# EAGLE design ESP_programmer_QFN_2 (EAGLE 8.1.1)
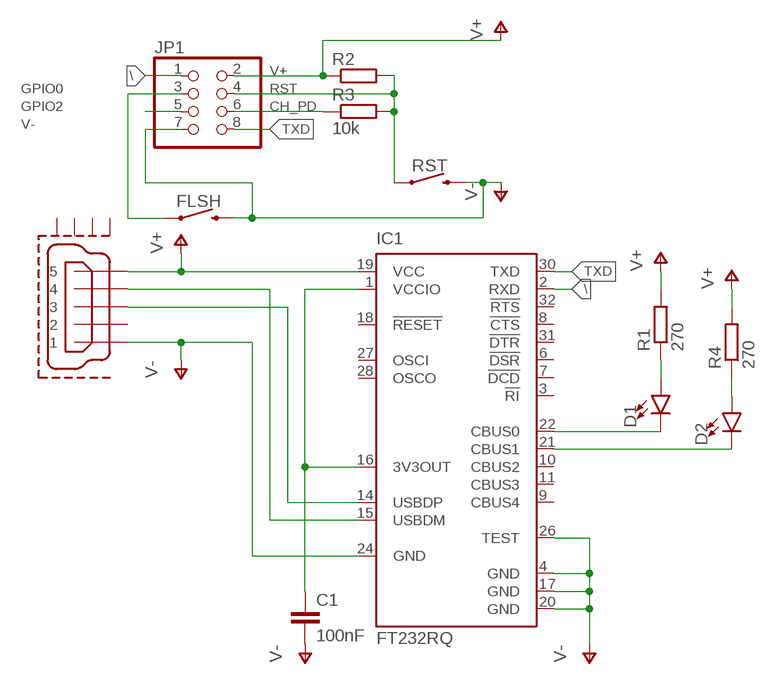
[diagram p0: schematic, sheet 1]

## Parts
C1  100nF  C-EUC1608  [C1608]
D1  TX  LED-BLUE0603  [LED-0603]
D2  RX  LED-BLUE0603  [LED-0603]
FLSH  MOMENTARY-SWITCH-SPST-SMD-5.2-REDUNDANT  [TACTILE_SWITCH_SMD_5.2MM]
IC1  FT232RQ  [QFN32]
JP1  PINHD-2X4  [2X04]
R1  270  RR2012  [R2012]
R2  10k  RR2012  [R2012]
R3  10k  RR2012  [R2012]
R4  270  RR2012  [R2012]
RST  MOMENTARY-SWITCH-SPST-SMD-5.2-REDUNDANT  [TACTILE_SWITCH_SMD_5.2MM]
U1  MICRO-USB-RECEPTACLE47589-0001  [47589-0001]

## Nets
\: IC1.2(RXD) JP1.1
CH_PD: JP1.6 R3.1
GPIO0: FLSH.1 FLSH.2 JP1.3
GPIO2: JP1.5
N$1: D2.A R4.1
N$2: IC1.15(USBDM) U1.4
N$3: IC1.14(USBDP) U1.3
N$4: D1.A R1.1
N$5: C1.1 IC1.1(VCCIO) IC1.16(3V3OUT)
N$6: D1.C IC1.22(CBUS0)
N$8: D2.C IC1.21(CBUS1)
RST: JP1.4 R2.2 R3.2 RST.1 RST.2
TXD: IC1.30(TXD) JP1.8
V+: IC1.19(VCC) JP1.2 R1.2 R2.1 R4.2 U1.5
V-: C1.2 FLSH.3 FLSH.4 IC1.4(GND) IC1.17(GND) IC1.20(GND) IC1.24(GND) IC1.26(TEST) JP1.7 RST.3 RST.4 U1.1
Unconnected: IC1.3(!RI) IC1.6(!DSR) IC1.7(!DCD) IC1.8(!CTS) IC1.9(CBUS4) IC1.10(CBUS2) IC1.11(CBUS3) IC1.18(!RESET) IC1.27(OSCI) IC1.28(OSCO) IC1.31(!DTR) IC1.32(!RTS) U1.2 U1.CASING1(GND1) U1.CASING2(GND2) U1.CASING3(GND3) U1.CASING4(GND4)

## Library data of the parts
C1 = resistor:C-EU: CAPACITOR, European symbol
D1 D2 = SparkFun-LED:LED-BLUE: Blue SMD LED Used in manufacturing of various products at SparkFun Packages: 0603 - SMD 0603 package [Product Link] <http://www.digikey.com/product-detail/en/SMLE12BC7TT86/511-1589-2-ND/1641808> 1206 - SMD1206 package [Product Link] <http://www.digikey.com/product-detail/en/lite-on-inc/LTST-C150TBKT/160-1643-1-ND/573584> SparkFun Products: ESP8266 Thing-Dev Board <https://www.sparkfun.com/products/13711> RedBoard <https://www.sparkfun.com/products/12757>; PROD_ID: DIO-08575; VALUE: BLUE
FLSH RST = SparkFun-Switches:MOMENTARY-SWITCH-SPST: Momentary Switch (Pushbutton) - SPST Normally-open (NO) SPST momentary switches (buttons, pushbuttons). Variants PTH-12MM - 12mm square, through-hole Momentary Pushbutton Switch - 12mm Square <https://www.sparkfun.com/products/9190> (COM-09190) PTH-6.0MM, PTH-6.0MM-KIT - 6.0mm square, through-hole Mini Pushbutton Switch <https://www.sparkfun.com/products/97> (COM-00097) KIT package intended for soldering kit's - only one side of pads' copper is exposed. PTH-RIGHT-ANGLE-KIT - Right-angle, through-hole Right Angle Tactile Button <https://www.sparkfun.com/products/10791> - Used on SparkFun BigTime Watch Kit <https://www.sparkfun.com/products/11734> SMD-12MM - 12mm square, surface-mount Tactile Button - SMD (12mm) <https://www.sparkfun.com/products/12993> (COM-12993) Used on SparkFun PicoBoard <https://www.sparkfun.com/products/11888> SMD-4.5MM - 4.5mm Square Trackball Switch Used on SparkFun Blackberry Trackballer Breakout <https://www.sparkfun.com/products/13169> SMD-4.6MMX2.8MM - 4.60mm x 2.80mm, surface mount Used on SparkFun SAMD21 Mini Breakout <https://www.sparkfun.com/products/13664> SMD-5.2MM, SMD-5.2-REDUNDANT - 5.2mm square, surface-mount Mini Pushbutton Switch - SMD <https://www.sparkfun.com/products/8720> (COM-08720) Used on Arduino Pro Mini <https://www.sparkfun.com/products/11114> REDUNDANT package connects both switch circuits together SMD-6.0X3.5MM - 6.0 x 3.5mm, surface mount Momentary Reset Switch SMD <https://www.sparkfun.com/products/8229> (COM-08229) SMD-6.2MM-TALL - 6.2mm square, surface mount Tactile Button - SMD (6mm) <https://www.sparkfun.com/products/12992> Used on SparkFun Digital Sandbox <https://www.sparkfun.com/products/12651> SMD-RIGHT-ANGLE - Right-angle, surface mount Used on SparkFun Block for Intel® Edison - Arduino <https://www.sparkfun.com/products/13036>; PROD_ID: SWCH-08247; SF_SKU: COM-08720
IC1 = ftdichip:FT232R: Source: http://www.ftdichip.com/Documents/DataSheets/DS_FT232R_v104.pdf; MPN: FT232RQ; OC_FARNELL: 1146033; OC_NEWARK: 91K9919
JP1 = FPAA_pinhead:PINHD-2X4: PIN HEADER
R1-R4 = eagle-ltspice:R: RESISTOR, European symbol; SPICEMODEL: NONE; SPICEPREFIX: R
U1 = con-molex-usb:MICRO-USB-RECEPTACLE: MICRO USB RECEPTACLES Micro-USB Receptacles, SMT, Lead-Free from MOLEX <http://www.molex.com/>. (C) 2014 Tomasz Boleslaw CEDRO, cederom@tlen.pl, http://www.tomek.cedro.info. Version 0.1 (2014-01-17): Initial release. Version 0.2 (2014-02-06): Updated 47589-0001 footprint pins/pads/milling. Following devices are included: 1. 47589-0001 Micro-USB AB Receptacle, Bottom Mount, SMT, Lead-Free <http://www.molex.com/molex/products/datasheet.jsp?part=active/0475890001_IO_CONNECTORS.xml> (Technical Drawing <http://www.molex.com/pdm_docs/sd/475890001_sd.pdf>).

## Board
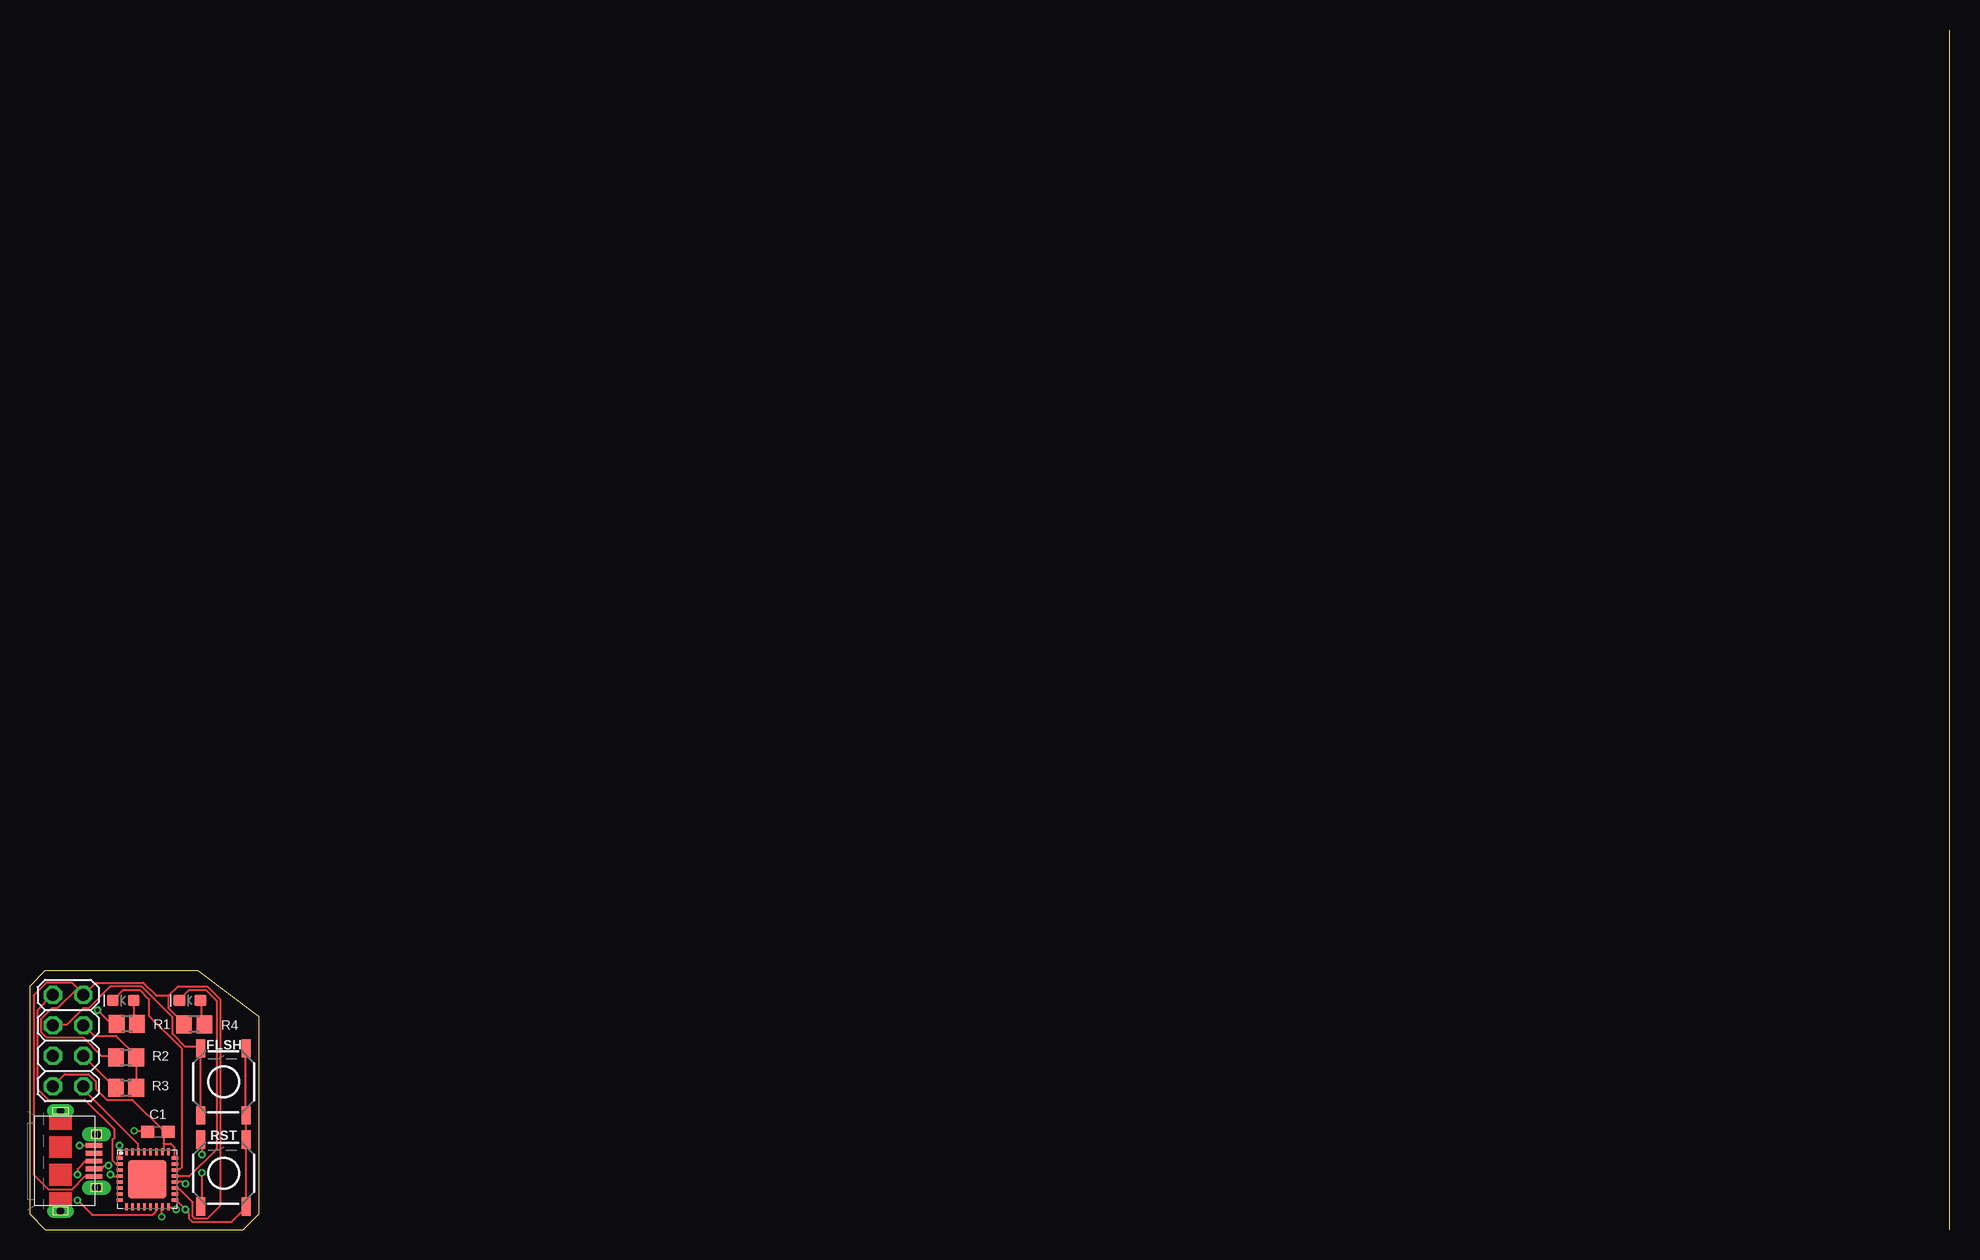
[diagram p1: board, top side]
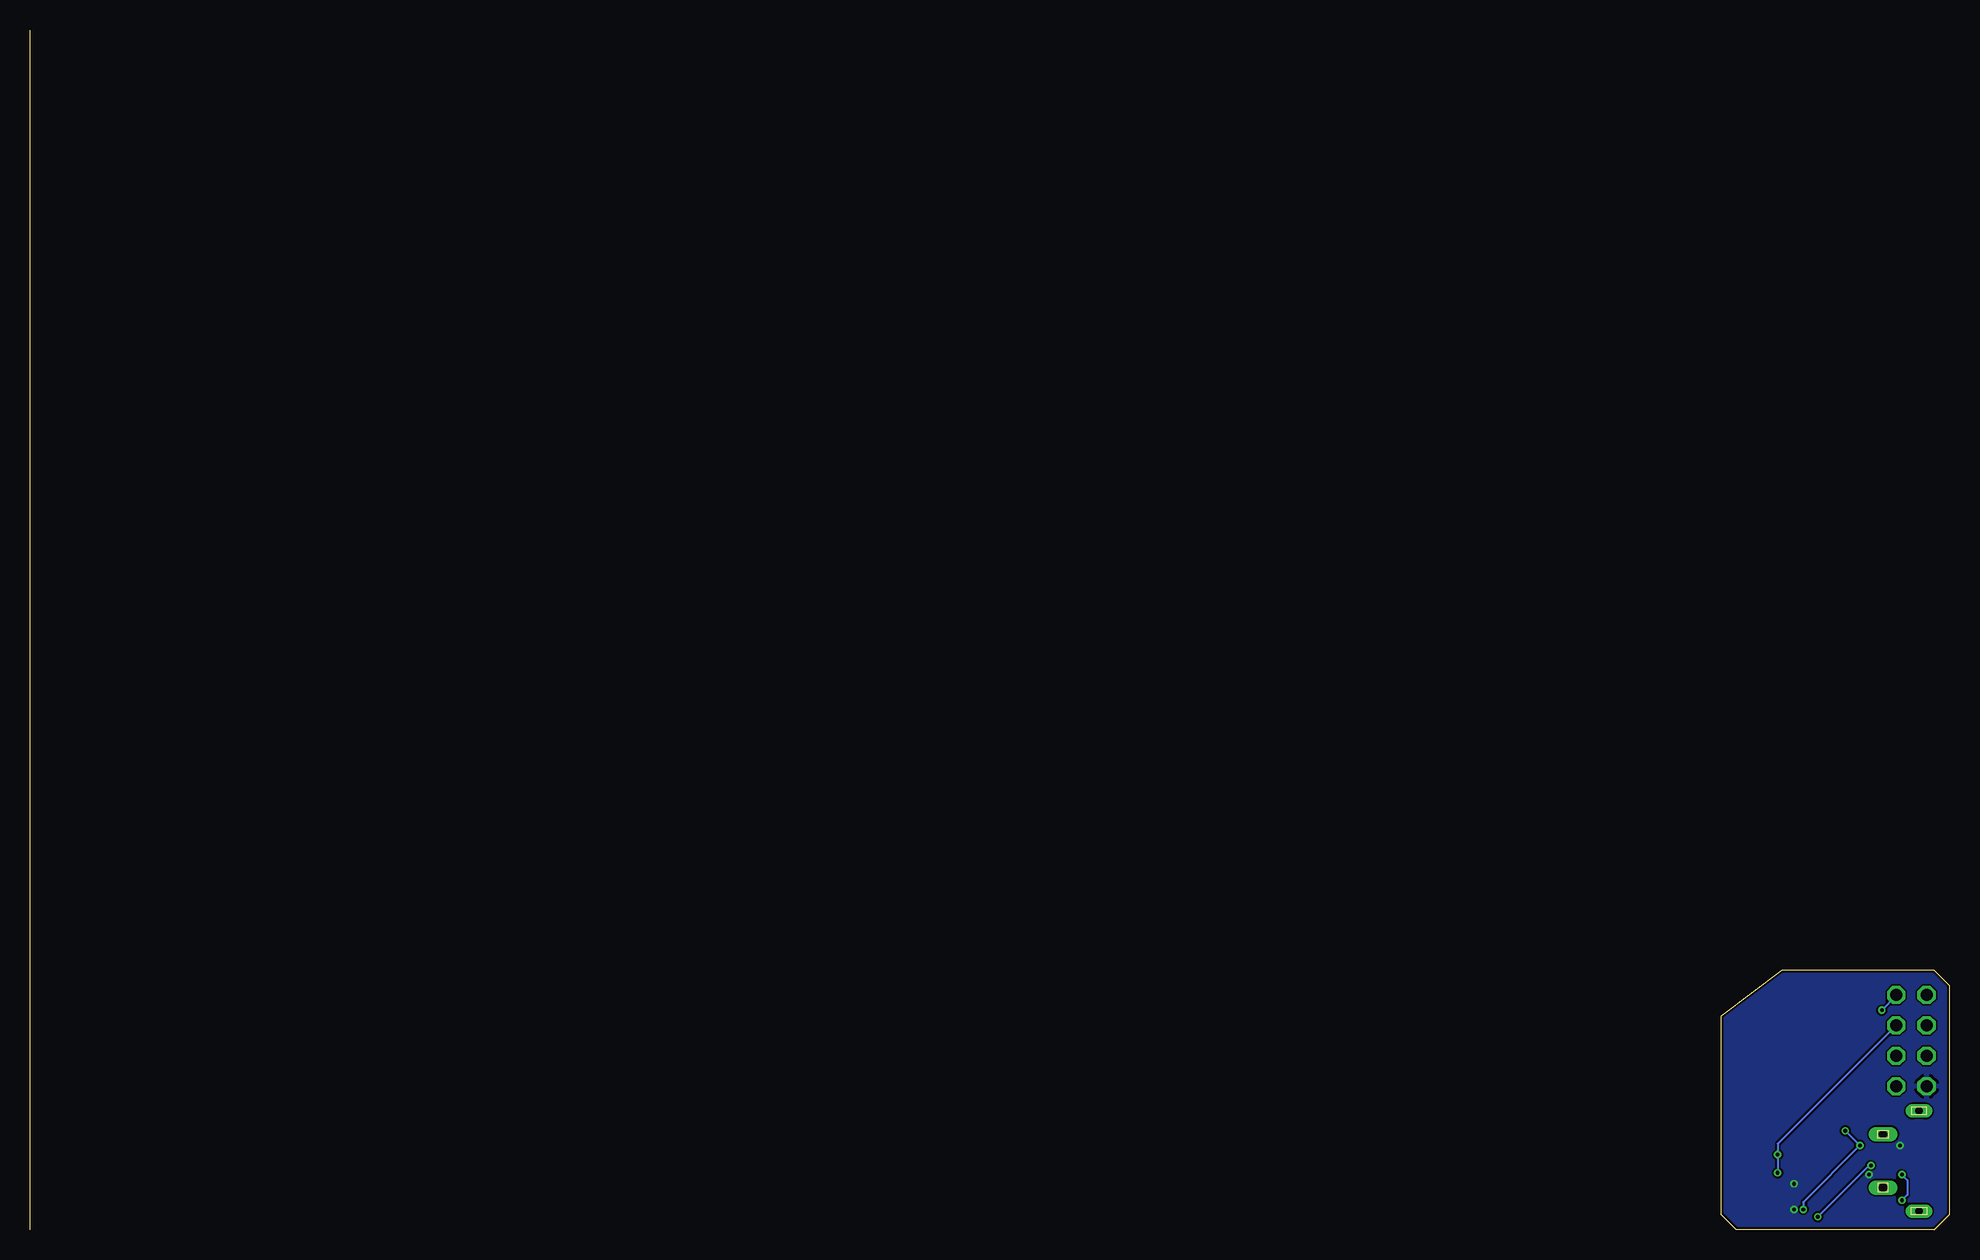
[diagram p2: board, bottom side, seen from below]

Size 160 x 100 mm. Coordinates in mm from the lower left corner, seen from the top.
Outline: 160,0 160,100
Outline: 1.27,0 0,1.27 0,20.32 1.27,21.59 13.97,21.59 19.05,17.78 19.05,1.27 17.78,0 1.27,0
Copper layers (1*16): Top 0.035mm / dielectric 1.5mm / Bottom 0.035mm
Design rules "SeeedStudio_2layer_DRU_no_angle_20140221 *": minimum track width 6mil, minimum drill 12mil, track to track 6mil, track to pad 6mil, pad to pad 6mil, via to via 6mil, smd to smd 0mil, copper to edge 8mil, drill to drill 10mil, minimum pad ring 10mil, minimum via ring 6mil, stop-mask expansion 2mil, vias tented up to drill 100mil, thermal gap 10mil

### Footprints (pad centres in the part's own frame; a part is rotated, then mirrored left to right if it is on the bottom)
C1608 = smd 1.1 x 1: 1 -0.85,0; 2 0.85,0
LED-0603 = smd 1 x 1: A -0.877,0; C 0.877,0
TACTILE_SWITCH_SMD_5.2MM = smd 1.524 x 0.762: 1 -2.794,1.905; 2 2.794,1.905; 3 -2.794,-1.905; 4 2.794,-1.905
QFN32 = smd 0.6 x 0.3: 1 -2.3,1.75; 2 -2.3,1.25; 3 -2.3,0.75; 4 -2.3,0.25; 5 -2.3,-0.25; 6 -2.3,-0.75; 7 -2.3,-1.25; 8 -2.3,-1.75; 17 2.3,-1.75; 18 2.3,-1.25; 19 2.3,-0.75; 20 2.3,-0.25; 21 2.3,0.25; 22 2.3,0.75; 23 2.3,1.25; 24 2.3,1.75 | smd 0.3 x 0.6: 9 -1.75,-2.3; 10 -1.25,-2.3; 11 -0.75,-2.3; 12 -0.25,-2.3; 13 0.25,-2.3; 14 0.75,-2.3; 15 1.25,-2.3; 16 1.75,-2.3; 25 1.75,2.3; 26 1.25,2.3; 27 0.75,2.3; 28 0.25,2.3; 29 -0.25,2.3; 30 -0.75,2.3; 31 -1.25,2.3; 32 -1.75,2.3 | smd 3.2 x 3.2: EXP 0,0
2X04 = drill 1.016 octagon: 1 -3.81,-1.27; 2 -3.81,1.27; 3 -1.27,-1.27; 4 -1.27,1.27; 5 1.27,-1.27; 6 1.27,1.27; 7 3.81,-1.27; 8 3.81,1.27
R2012 = smd 1.3 x 1.5: 1 -0.85,0; 2 0.85,0
47589-0001 = smd 1.35 x 0.4: 1 2.8,1.3; 2 2.8,0.65; 3 2.8,0; 4 2.8,-0.65; 5 2.8,-1.3 | drill 0.6 pad 0.95 long: CASING1 0,4.175; CASING2 0,-4.175 | drill 0.7 pad 1.1 long: CASING3 3,2.225; CASING4 3,-2.225

### Placement (x,y rotation side)
C1  10.67,8.13 0 top
D1  7.77,19.1 180 top
D2  13.34,19.1 180 top
FLSH  16.13,12.32 90 top
IC1  9.78,4.19 0 top
JP1  3.17,15.75 270 top
R1  8.08,17.14 180 top
R2  8,14.35 0 top
R3  8,11.81 0 top
R4  13.69,17.12 180 top
RST  16.13,4.7 90 top
U1  2.54,5.71 0 top

### Tracks (layer width: path | path; a pad name or v marks a point on that pad's centre or on a via)
\
  Top 0.152: IC1.2 7.47,5.49 7.16,5.49 6.86,5.79 6.86,7.47 7.01,7.62 7.01,8.38 4.57,10.82 1.52,10.82 0.61,11.73 0.61,18.29 1.83,19.51 JP1.1
CH_PD
  Top 0.152: R3.1 7.01,11.89 4.42,14.48 JP1.6
GPIO0
  Top 0.152: FLSH.1 14.17,9.6 14.17,15.09 FLSH.2 14.17,15.24 12.95,15.24 11.89,16.31 11.89,17.68 9.3,20.27 6.71,20.27 4.88,18.44 4.42,18.44 3.05,17.07 1.98,17.07 JP1.3
N$1
  Top 0.152: D2.A 14.33,19.05 14.33,17.37 14.48,17.22 R4.1
N$2  (via drill 0.3)
  Top 0.152: v10.97,1.07 10.97,1.83 IC1.15 | v6.55,5.33 6.25,5.33 6.1,5.18 5.49,5.18 U1.4
  Bottom 0.152: v10.97,1.07 6.71,5.33 v6.55,5.33
N$3  (via drill 0.3)
  Top 0.152: v3.96,2.44 5.18,1.22 10.21,1.22 10.52,1.52 10.52,1.83 IC1.14 | v3.96,4.57 3.96,5.03 4.57,5.64 5.33,5.64 U1.3
  Bottom 0.152: v3.96,2.44 3.5,2.9 3.5,4.12 v3.96,4.57
N$4
  Top 0.152: D1.A 8.69,19.05 8.69,17.37 8.84,17.22 R1.1
N$5  (via drill 0.3)
  Top 0.152: v12.19,1.68 12.04,1.83 11.58,1.83 IC1.16 | v7.47,7.01 7.47,5.94 IC1.1 | v8.69,8.23 9.75,8.23 C1.1
  Bottom 0.152: v12.19,1.68 12.19,2.29 v7.47,7.01 v8.69,8.23
N$6
  Top 0.152: IC1.22 12.19,5.03 12.5,5.03 12.65,5.18 12.65,15.09 9.91,17.83 9.91,19.2 9.14,19.96 7.77,19.96 7.01,19.2 D1.C
N$8
  Top 0.152: IC1.21 12.19,4.42 13.26,4.42 15.54,6.71 15.54,19.05 14.63,19.96 13.26,19.96 12.5,19.2 D2.C
RST  (via drill 0.3)
  Top 0.152: v14.33,4.72 14.33,1.98 RST.1 | v14.33,6.25 14.33,7.47 RST.2 | R3.2 8.84,11.89 8.84,14.33 R2.2 8.84,14.48 7.16,16.15 5.33,16.15 4.57,16.92 JP1.4
  Bottom 0.152: v14.33,4.72 v14.33,6.25 14.33,7.16 4.57,16.92 JP1.4
TXD
  Top 0.152: IC1.30 8.99,6.55 8.99,7.16 4.57,11.58 4.57,11.89 JP1.8
V+  (via drill 0.3)
  Top 0.152: 11.58,19.51 12.34,20.27 14.78,20.27 15.85,19.2 15.85,1.98 14.78,0.91 13.72,0.91 13.56,1.07 13.56,2.29 12.5,3.35 12.19,3.35 IC1.19 | 11.58,19.51 11.58,18.44 12.8,17.22 R4.2 | 3.96,20.12 4.42,19.66 JP1.2 | 3.96,20.12 3.5,20.57 1.37,20.57 0.3,19.51 0.3,4.57 1.52,3.35 3.5,3.35 4.57,4.42 U1.5 | 3.96,20.12 2.29,18.44 1.83,18.44 0.91,17.53 0.91,16.46 1.37,16 4.42,16 5.94,14.48 7.01,14.48 R2.1 | 3.96,20.12 JP1.2 | v5.64,18.29 6.71,17.22 7.16,17.22 R1.2 | 11.58,19.51 10.52,19.51 9.45,20.57 5.49,20.57 4.57,19.66 JP1.2
  Bottom 0.152: v5.64,18.29 4.42,19.51 JP1.2
V-  (via drill 0.3)
  Top 0.152: 11.12,7.16 11.12,7.77 11.43,8.08 C1.2 11.43,8.23 11.12,8.23 8.53,10.82 6.4,10.82 5.49,11.73 5.49,12.34 4.88,12.95 2.9,12.95 1.98,12.04 JP1.7 | 11.12,7.16 11.12,6.55 IC1.26 | 11.12,7.16 11.73,7.16 12.04,6.86 12.04,5.94 IC1.24 | v6.71,4.57 6.86,4.42 7.47,4.42 IC1.4 | v12.95,3.81 12.8,3.96 12.19,3.96 IC1.20 | v4.12,7.01 U1.1 | IC1.17 12.19,2.44 v12.95,1.68 13.26,1.37 13.26,0.91 13.56,0.61 16.76,0.61 17.98,1.83 RST.3 17.98,1.98 17.98,7.47 RST.4 17.98,7.62 17.98,9.45 FLSH.3 17.98,9.6 17.98,15.09 FLSH.4
  pour Bottom: 4.83,25.53 -2.16,18.54 -2.16,2.29 1.27,-1.14 19.94,-1.14 20.32,-0.76 20.32,24.89 19.43,25.78 5.08,25.78